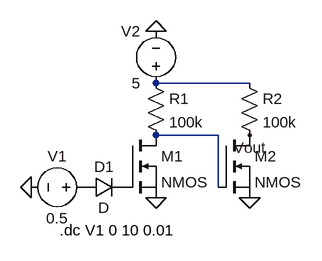
[diagram p0: schematic not_gate.asc]
not_gate.asc, the LTspice schematic file:
Version 4
SHEET 1 880 680
WIRE 352 -144 208 -144
WIRE 304 -64 208 -64
WIRE 304 16 304 -64
FLAG 208 32 0
FLAG 16 16 0
FLAG 208 -224 0
FLAG 352 -64 Vout
FLAG 352 32 0
SYMBOL nmos 160 -64 R0
SYMATTR InstName M1
SYMBOL voltage 112 16 R90
WINDOW 0 -32 56 VBottom 2
WINDOW 3 32 56 VTop 2
WINDOW 123 0 0 Left 0
WINDOW 39 0 0 Left 0
SYMATTR InstName V1
SYMATTR Value 0.5
SYMBOL res 192 -160 R0
SYMATTR InstName R1
SYMATTR Value 100k
SYMBOL voltage 208 -128 R180
WINDOW 0 24 96 Left 2
WINDOW 3 24 16 Left 2
WINDOW 123 0 0 Left 0
WINDOW 39 0 0 Left 0
SYMATTR InstName V2
SYMATTR Value 5
SYMBOL nmos 304 -64 R0
SYMATTR InstName M2
SYMBOL res 336 -160 R0
SYMATTR InstName R2
SYMATTR Value 100k
SYMBOL diode 96 32 R270
WINDOW 0 32 32 VTop 2
WINDOW 3 0 32 VBottom 2
SYMATTR InstName D1
TEXT 60 82 Left 2 !.dc V1 0 10 0.01

The netlist it stands for:
* not_gate.asc
M1 N002 P001 0 0 NMOS
V1 P002 0 0.5
R1 N001 N002 100k
V2 N001 0 5
M2 Vout N002 0 0 NMOS
R2 N001 Vout 100k
D1 P002 P001 D
.model D D
.lib standard.dio
.model NMOS NMOS
.model PMOS PMOS
.lib standard.mos
.dc V1 0 10 0.01
.backanno
.end